# EasyEDA Pro project ProProject_AstrAlim_2024-04-22.epro, board AstrAlim PCB
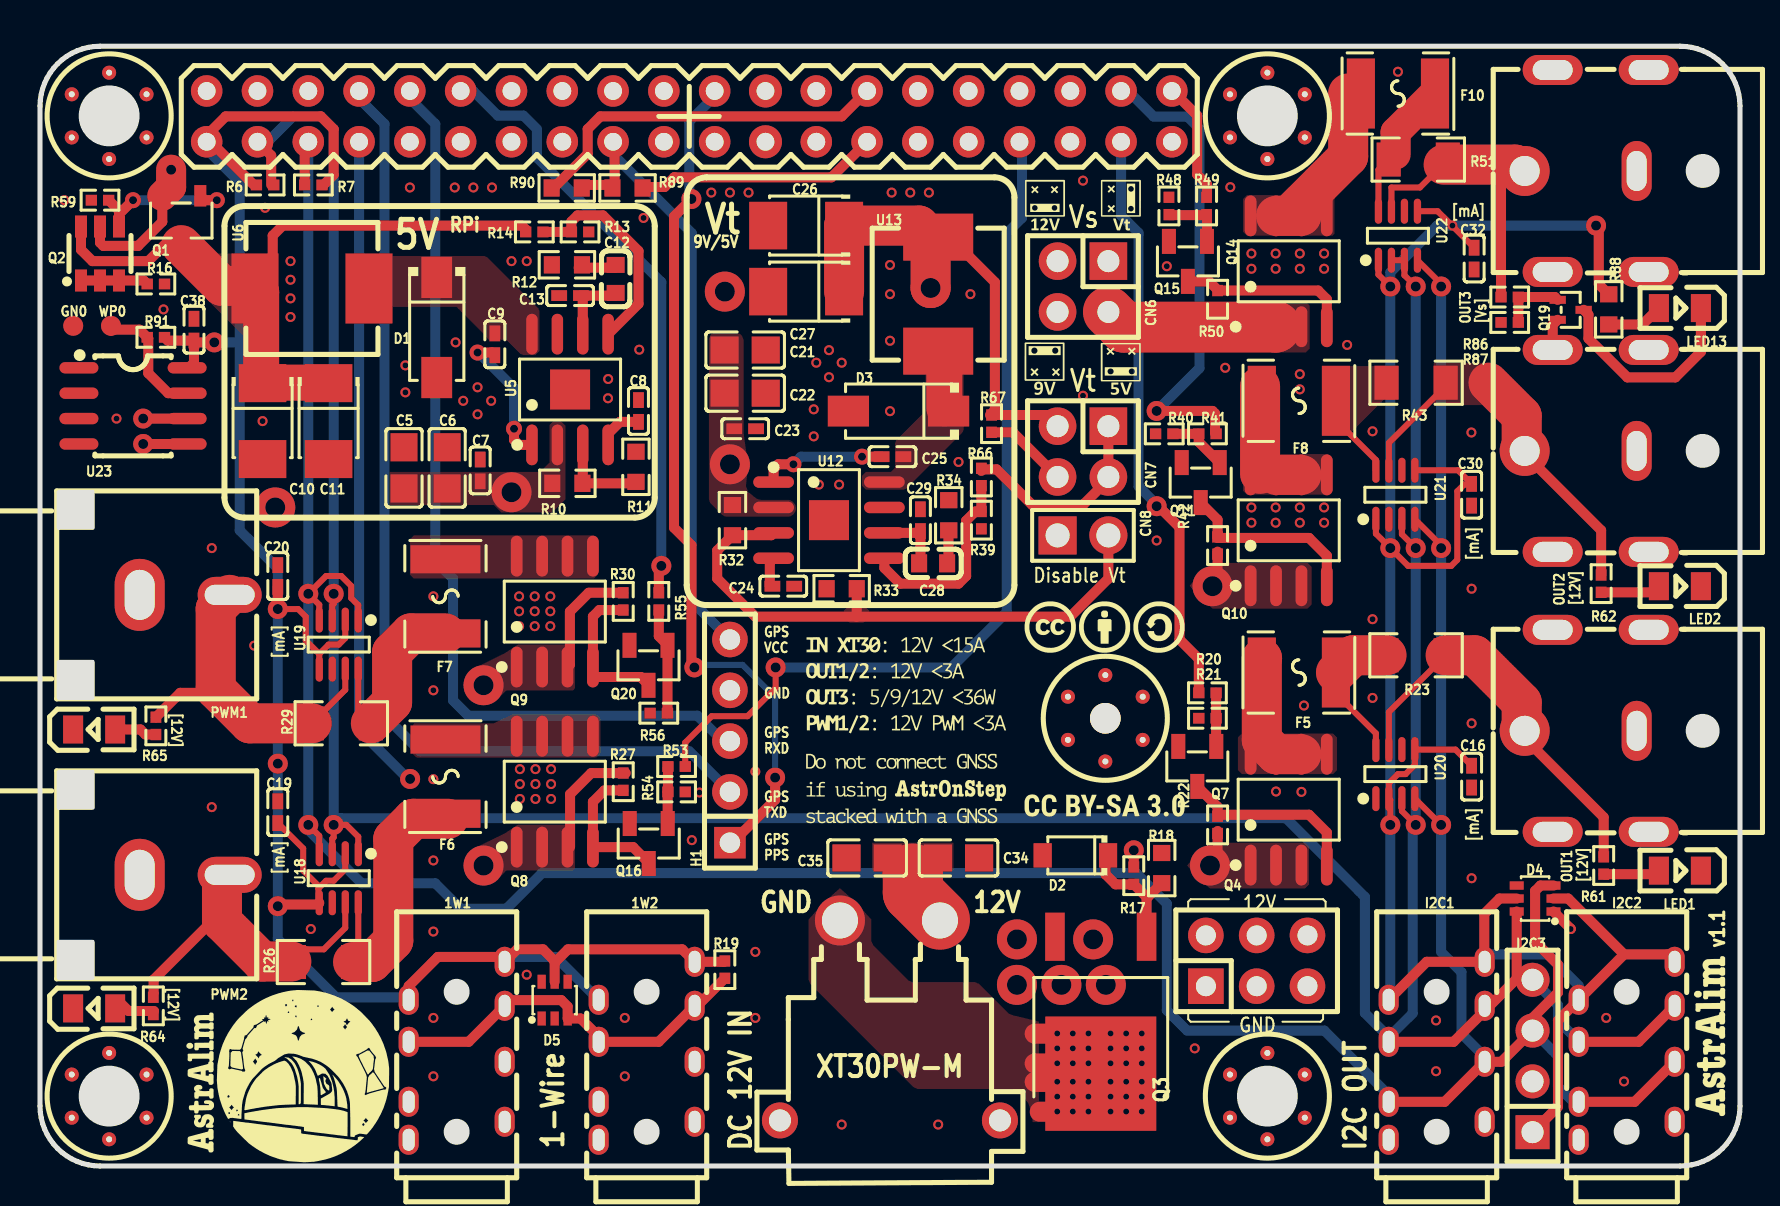
[diagram p2: board, top side]
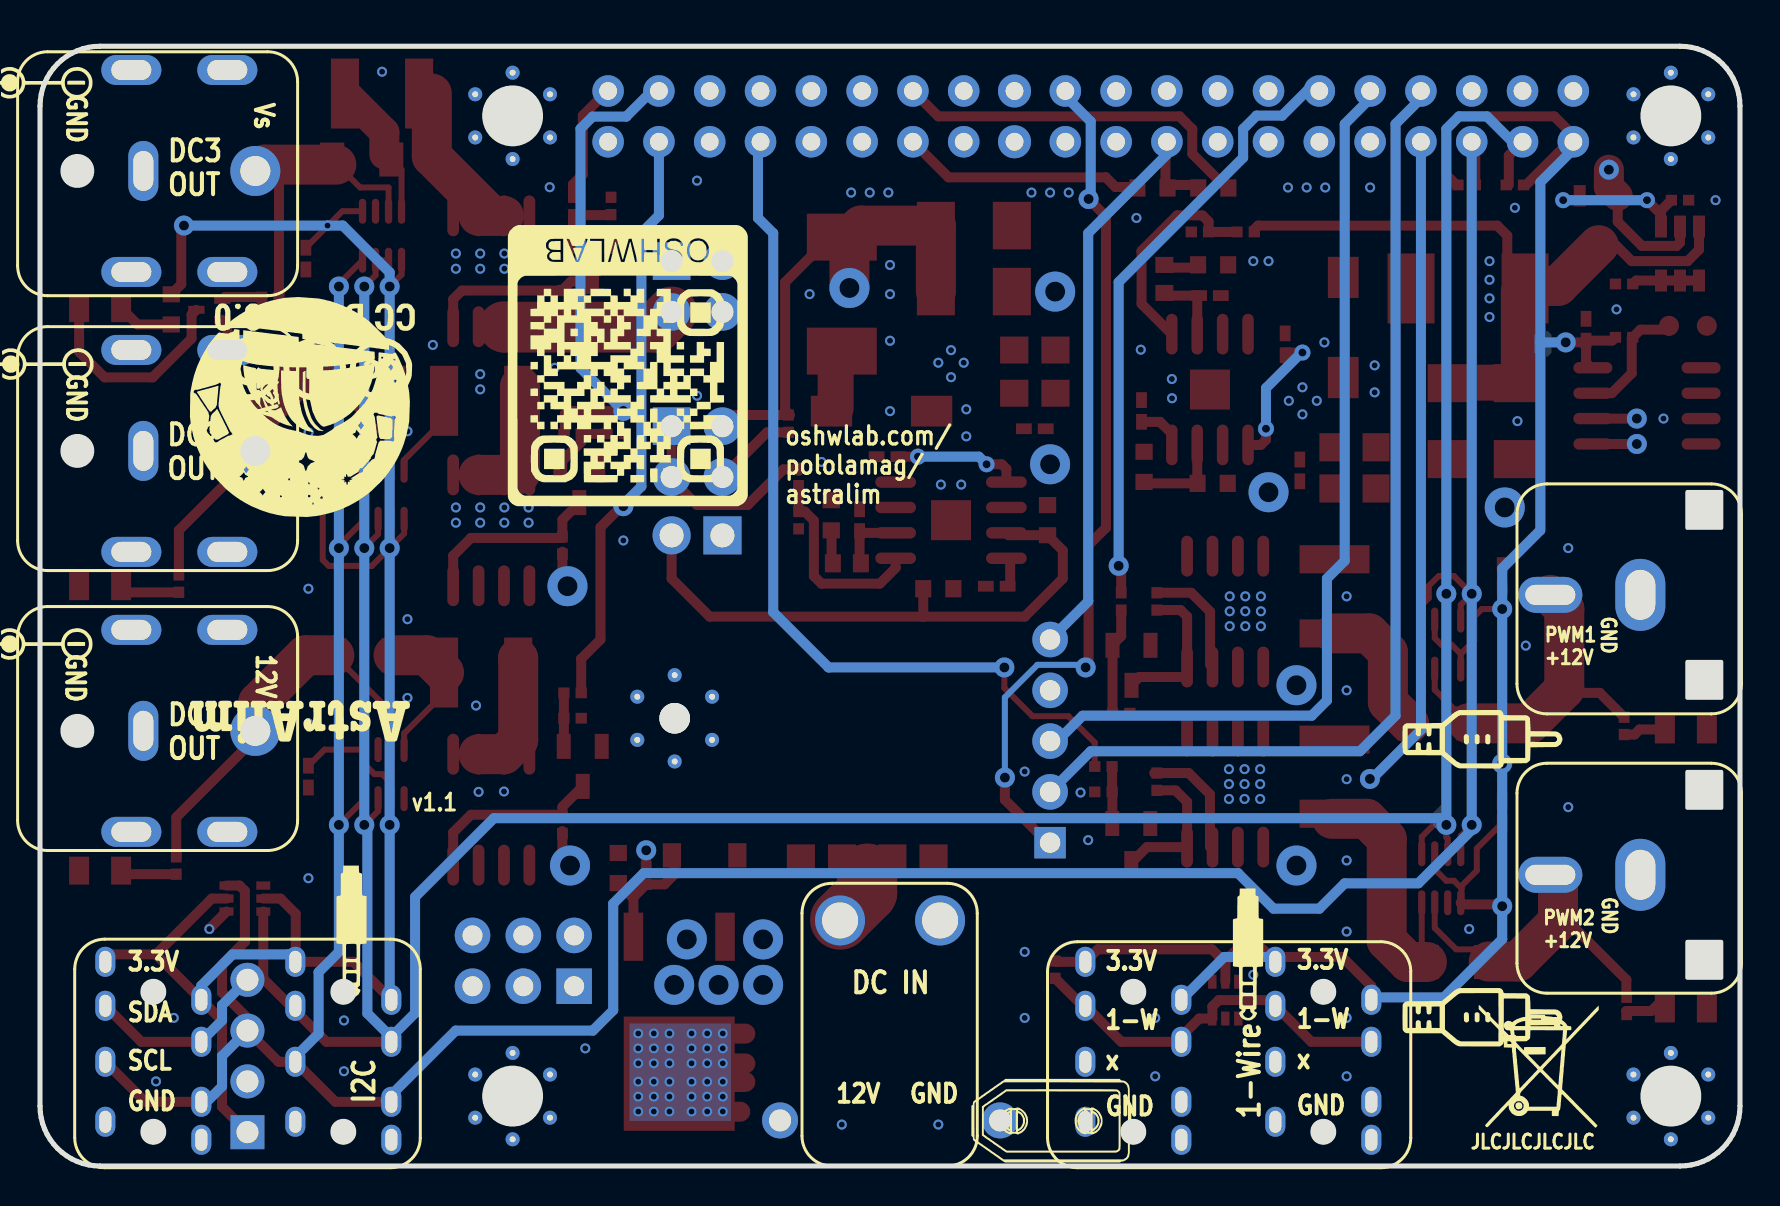
[diagram p3: board, bottom side, seen from below]

Outline 85 x 56 mm; copper layers: Top Layer, Inner1, Inner2, Inner3, Inner4, Inner5, Inner6, Inner7, Inner8, Inner9, Inner10, Inner11, Inner12, Inner13, Inner14, Inner15, Inner16, Inner17, Inner18, Inner19, Inner20, Inner21, Inner22, Inner23, Inner24, Inner25, Inner26, Inner27, Inner28, Inner29, Inner30, Bottom Layer. Coordinates in mm from the lower left corner of the outline.
Stack: Top Layer 0.035mm 外层铜厚1oz / Dielectric1 0.2104mm 7628 RC49% 8.6mil / Inner1 0.0152mm 内层铜厚 / Dielectric2 1.065mm 1.1mm H/HOZ 含铜 / Inner2 0.0152mm 内层铜厚 / Dielectric3 0.2104mm 7628 RC49% 8.6mil / Bottom Layer 0.035mm 外层铜厚1oz

## Design rules (mm)
template: Custom Config
spacing copperThickness1oz (default): track to track 0.102, other pairs 0.152 to 0.3
spacing copperThickness2oz: track to track 0.203, other pairs 0.152 to 0.3
spacing safeClearance1: track to track 0.152, other pairs 0.152 to 0.3
track width copperThickness1oz (default): min 0.3, default 0.5, max 6
track width copperThickness2oz: min 0.203, default 0.254, max 2.54
differential pair differentialPair (default): width min 0.127, default 0.254, max 2.54; gap min 0.152, default 0.152
via viaSize (default): diameter min 0.5, default 0.61, max 10; hole min 0.3, default 0.305, max 6.299

## Placement (name value [footprint] x y rotation side)
1W1  PJ-35372  [audio-th_pj-35372]  20.83 5.76 180 top
1W2  PJ-35372  [audio-th_pj-35372]  30.33 5.76 180 top
C5  4.7uF  [C0805]  18.2 34.91 270 top
C6  4.7uF  [C0805]  20.36 34.91 270 top
C7  10nF  [C0402]  22.01 34.79 270 top
C8  10nF  [C0402]  29.92 37.76 270 top
C9  10nF  [C0402]  22.74 41.09 90 top
C10  47uF  [CAP-SMD_L3.5-W2.8-R-RD]  11.13 37.25 90 top
C11  47uF  [CAP-SMD_L3.5-W2.8-R-RD]  14.43 37.25 90 top
C12  2.2nF  [C0603]  28.78 44.36 270 top
C13  22pF  [C0402]  26.5 43.53 0 top
C16  100nF  [C0402]  71.58 19.47 270 top
C19  100nF  [C0402]  11.89 17.69 90 top
C20  100nF  [C0402]  11.89 29.5 90 top
C21  4.7uF  [C0805]  35.26 40.81 180 top
C22  4.7uF  [C0805]  35.26 38.65 180 top
C23  10nF  [C0402]  35.26 36.87 180 top
C24  10nF  [C0402]  37.16 29 180 top
C25  10nF  [C0402]  42.62 35.47 0 top
C26  47uF  [CAP-SMD_L3.5-W2.8-R-RD]  38.31 47.03 0 top
C27  47uF  [CAP-SMD_L3.5-W2.8-R-RD]  38.31 43.73 0 top
C28  2.2nF  [C0603]  44.66 30.14 180 top
C29  22pF  [C0402]  44.02 32.3 270 top
C30  100nF  [C0402]  71.58 33.57 270 top
C32  100nF  [C0402]  71.71 45.38 270 top
C34  22uF  [C0805]  45.93 15.41 180 top
C35  22uF  [C0805]  41.35 15.41 0 top
C38  100nF  [C0402]  7.7 41.82 270 top
CN5  PM254-2-03-Z-8.5  [hdr-th_6p-p2.54-v-f-r2-c3-s2.54]  60.83 10.26 0 top
CN6  PH-00068  [HDR-TH_4P-P2.54-V-M-R2-C2-S2.54]  52.15 43.98 180 top
CN7  PH-00068  [HDR-TH_4P-P2.54-V-M-R2-C2-S2.54]  52.15 35.73 180 top
CN8  PZ254V-11-02P  [hdr-th_2p-p2.54-v-m]  52.15 31.54 0 top
D1  SS54  [SMA_L4.4-W2.8-LS5.4-R-RD]  19.84 41.94 270 top
D2  MM1Z15  [SOD-123_L2.7-W1.6-LS3.7-RD]  51.77 15.53 180 top
D3  SS54  [SMA_L4.4-W2.8-LS5.4-R-RD]  42.92 37.75 180 top
D4  BAV99S,115  [SOT-363_L2.0-W1.3-P0.65-LS2.1-TL]  74.75 13.38 180 top
D5  BAV99S,115  [SOT-363_L2.0-W1.3-P0.65-LS2.1-TL]  25.73 8.3 90 top
DC0  XT30PW-M  [CONN-TH_XT30PW-M]  42.5 7.28 0 top
DC1  DC-042C-W-2.0  [dc-in-th_dc-042c-w-2.0]  77.33 21.76 180 top
DC2  DC-042C-W-2.0  [dc-in-th_dc-042c-w-2.0]  77.33 35.76 180 top
DC3  DC-042C-W-2.0  [dc-in-th_dc-042c-w-2.0]  77.33 49.76 180 top
F5  SMD1812P300SLR/24  [F1812]  62.94 24.68 180 top
F6  SMD1812P300SLR/24  [F1812]  20.27 19.47 90 top
F7  SMD1812P300SLR/24  [F1812]  20.27 28.49 90 top
F8  SMD1812P300SLR/24  [F1812]  62.94 38.27 180 top
F10  SMD1812P300SLR/24  [F1812]  67.9 53.64 180 top
GN0  -  [test-point-0.5mm]  1.66 42.02 180 top
H1  2.54-1*5P  [hdr-th_5p-p2.54-v-f]  34.5 21.25 90 top
I2C1  PJ-35372  [audio-th_pj-35372]  69.83 5.76 180 top
I2C2  PJ-35372  [audio-th_pj-35372]  79.33 5.76 180 top
I2C3  2.54-1*4P  [hdr-th_4p-p2.54-v-f]  74.63 5.5 90 top
LED1  NCD0805R1  [LED0805-R-RD]  81.99 14.77 180 top
LED2  NCD0805R1  [LED0805-R-RD]  81.99 29 180 top
LED4  NCD0805R1  [LED0805-R-RD]  2.71 7.88 0 top
LED5  NCD0805R1  [LED0805-R-RD]  2.71 21.83 0 top
LED13  NCD0805R1  [LED0805-R-RD]  81.99 42.91 180 top
NOREF  -  [Pad_e1964]  51.4 21.31 0 top
NOREF#2  -  [Pad_e1969]  55.14 21.31 0 top
NOREF#3  -  [Pad_e1977]  53.27 24.55 0 top
NOREF#4  -  [Pad_e599]  53.27 22.39 180 top
NOREF#5  -  [Pad_e1971]  55.14 23.47 0 top
NOREF#6  -  [Pad_e1967]  53.27 20.23 0 top
NOREF#7  -  [Pad_e1979]  51.4 23.47 0 top
PWM1  AV-5  [rcj-04]  6.93 28.56 270 top
PWM2  AV-5  [rcj-04]  6.93 14.56 270 top
Q1  DMMT5401-7-F  [SOT-23-6_L2.9-W1.6-P0.95-LS2.8-BR]  3 45.63 270 top
Q2  AP2317A  [SOT-23-3_L2.9-W1.6-P1.90-LS2.8-BR]  7.06 47.28 90 top
Q3  DMTH4004LK3-13  [TO-252-2_L6.6-W6.1-P4.58-LS9.9-TL]  53.04 8.04 270 top
Q4  NCE30P12S  [soic-8_l4.9-w3.9-p1.27-ls6.0-bl]  62.44 17.82 0 top
Q7  MMBT3904  [SOT-23-3_L2.9-W1.3-P1.90-LS2.4-BR]  57.87 19.98 90 top
Q8  NCE30P12S  [SOIC-8_L4.9-W3.9-P1.27-LS6.0-BL]  25.74 18.72 0 top
Q9  NCE30P12S  [SOIC-8_L4.9-W3.9-P1.27-LS6.0-BL]  25.74 27.73 0 top
Q10  NCE30P12S  [soic-8_l4.9-w3.9-p1.27-ls6.0-bl]  62.44 31.79 0 top
Q11  MMBT3904  [SOT-23-3_L2.9-W1.3-P1.90-LS2.4-BR]  58.03 34.18 90 top
Q14  NCE30P12S  [SOIC-8_L4.9-W3.9-P1.27-LS6.0-BL]  62.44 44.75 0 top
Q15  MMBT3904  [SOT-23-3_L2.9-W1.3-P1.90-LS2.4-BR]  57.4 45.24 90 top
Q16  MMBT3904  [SOT-23-3_L2.9-W1.3-P1.90-LS2.4-BR]  30.44 16.13 90 top
Q19  MMBT3904TT1G  [SC-75-3_L1.6-W0.8-P1.00-LS1.6-BR]  76.53 42.82 180 top
Q20  MMBT3904  [SOT-23-3_L2.9-W1.3-P1.90-LS2.4-BR]  30.43 25.04 90 top
R6  10kΩ  [R0402]  11.26 49.06 180 top
R7  10kΩ  [R0402]  13.67 49.06 0 top
R10  665kΩ  [R0603]  26.37 34.14 180 top
R11  130kΩ  [R0603]  29.8 34.97 270 top
R12  39kΩ  [R0603]  26.35 45.07 180 top
R13  1.96kΩ  [R0402]  27 46.71 180 top
R14  10.2kΩ  [R0402]  24.72 46.71 180 top
R16  10kΩ  [R0402]  5.79 44.11 180 top
R17  1kΩ  [R0402]  54.69 14.52 270 top
R18  470kΩ  [R0603]  56.09 14.9 270 top
R19  4.7kΩ  [R0402]  34.24 9.82 90 top
R20  10kΩ  [R0402]  58.37 22.39 0 top
R21  1kΩ  [R0402]  58.37 23.66 0 top
R22  1kΩ  [R0402]  58.88 17.06 270 top
R23  10mΩ  [R1206]  68.8 25.54 180 top
R26  10mΩ  [R1206]  14.18 10.2 0 top
R27  1kΩ  [R0402]  29.16 19.22 90 top
R29  10mΩ  [R1206]  15.06 22.14 0 top
R30  1kΩ  [R0402]  29.16 28.23 90 top
R32  665kΩ  [R0603]  34.62 32.3 90 top
R33  82kΩ  [R0603]  40.08 28.87 0 top
R34  39kΩ  [R0603]  45.44 32.54 90 top
R39  1.96kΩ  [R0402]  47.07 32.3 90 top
R40  10kΩ  [R0402]  56.21 36.62 0 top
R41  1kΩ  [R0402]  58.37 36.62 180 top
R42  1kΩ  [R0402]  58.88 31.03 270 top
R43  10mΩ  [R1206]  68.8 39.17 180 top
R48  10kΩ  [R0402]  56.45 48.01 270 top
R49  1kΩ  [R0402]  58.33 48.01 270 top
R50  1kΩ  [R0402]  58.88 43.35 270 top
R51  10mΩ  [R1206]  68.91 50.33 180 top
R53  1kΩ  [R0402]  31.83 19.98 180 top
R54  10kΩ  [R0402]  31.83 18.71 180 top
R55  1kΩ  [R0402]  30.94 28.23 270 top
R56  10kΩ  [R0402]  30.94 22.65 0 top
R59  47kΩ  [R0402]  3 48.3 0 top
R61  470Ω  [R0402]  78.18 15.03 270 top
R62  470Ω  [R0402]  78.06 29.12 270 top
R64  470Ω  [R0402]  5.67 8.01 270 top
R65  470Ω  [R0402]  5.79 22.01 270 top
R66  10.2kΩ  [R0402]  47.07 34.46 90 top
R67  10kΩ  [R0402]  47.58 37.12 90 top
R86  10kΩ  [R0402]  73.49 43.46 180 top
R87  10kΩ  [R0402]  73.49 42.19 0 top
R88  68Ω  [R0603]  78.44 42.84 270 top
R89  3.9kΩ  [R0603]  29.38 48.91 180 top
R90  3.9kΩ  [R0603]  26.34 48.91 0 top
R91  1kΩ  [R0402]  5.79 41.44 0 top
U0  RASPI HAT FULL  [rasberrypi-3-hat-ext]  8.33 53.76 0 top
U5  TPS54531DDAR  [SOIC-8_L5.0-W4.0-P1.27-LS6.0-BL-EP2.0]  26.5 38.83 0 top
U6  4.7uH  [IND-SMD_L7.2-W6.6_GPSR07X0]  13.6 43.89 180 top
U12  TPS54531DDAR  [SOIC-8_L5.0-W4.0-P1.27-LS6.0-BL-EP2.0]  39.45 32.3 270 top
U13  4.7uH  [IND-SMD_L7.2-W6.6_GPSR07X0]  44.91 43.6 90 top
U18  INA219AIDCNR  [sot-23-8_l3.0-w1.7-p0.65-ls2.8-br]  14.94 14.39 90 top
U19  INA219AIDCNR  [sot-23-8_l3.0-w1.7-p0.65-ls2.8-br]  14.94 26.08 90 top
U20  INA219AIDCNR  [sot-23-8_l3.0-w1.7-p0.65-ls2.8-br]  67.77 19.6 270 top
U21  INA219AIDCNR  [sot-23-8_l3.0-w1.7-p0.65-ls2.8-br]  67.77 33.57 270 top
U22  INA219AIDCNR  [sot-23-8_l3.0-w1.7-p0.65-ls2.8-br]  67.9 46.52 270 top
U23  AT24C32D-SSHM-T  [SOIC-8_L5.0-W4.0-P1.27-LS6.0-BL]  4.65 38.01 270 top
WP0  -  [test-point-0.5mm]  3.55 42.02 180 top

## Footprints (pads in the part's own frame, mm; a bottom-side part is the same pattern mirrored in y, then rotated)
audio-th_pj-35372
  oval 1x1.5 hole 0.6x1.1: 1(-2.4,3.55) 2(-2.4,0.55) 3(-2.4,-2.25) 4(-2.4,-4.45) 5(2.4,4.45) 6(2.4,2.55) 7(2.4,-0.45) 8(2.4,-2.55)
C0402
  rect 0.79x0.54 smd: 1(-0.545,0) 2(0.545,0)
C0603
  rect 0.8x0.9 smd: 1(-0.7,0) 2(0.7,0)
C0805
  rect 1.41x1.35 smd: 1(-1.03,0) 2(1.03,0)
CAP-SMD_L3.5-W2.8-R-RD
  rect 1.9x2.376 smd: 1(1.899,0) 2(-1.899,0)
CONN-TH_XT30PW-M
  round 2.5 hole 1.8: 1(-2.5,5) 2(2.5,5)
  round 1.8 hole 1.1: 3(5.5,-5) 4(-5.5,-5)
dc-in-th_dc-042c-w-2.0
  oval 3x1.5 hole 2x1: 2(-3.1,5.05) 2(-3.1,-5.05) 2(1.7,5.05) 2(1.7,-5.05)
  oval 1.5x3 hole 1x2: 3(-2.5,0)
  round 2.5 hole 1.5: 4(3.1,0)
F1812
  rect 1.407x3.499 smd: 1(-1.853,0) 2(1.853,0)
hdr-th_2p-p2.54-v-m
  rect 1.905x1.905 hole 1.2: 1(-1.27,0)
  round 1.905 hole 1.2: 2(1.27,0)
hdr-th_4p-p2.54-v-f
  rect 1.7x1.7 hole 1.1: 1(-3.81,0)
  round 1.7 hole 1.1: 2(-1.27,0) 3(1.27,0) 4(3.81,0)
HDR-TH_4P-P2.54-V-M-R2-C2-S2.54
  rect 1.879x1.879 hole 1.1: 1(-1.27,-1.27)
  round 1.879 hole 1.1: 2(-1.27,1.27) 3(1.27,-1.27) 4(1.27,1.27)
hdr-th_5p-p2.54-v-f
  rect 1.575x1.575 hole 1.02: 1(-5.08,0)
  round 1.778 hole 1.02: 2(-2.54,0) 3(0,0) 4(2.54,0) 5(5.08,0)
hdr-th_6p-p2.54-v-f-r2-c3-s2.54
  rect 1.778x1.778 hole 1: 1(-2.54,-1.27)
  round 1.778 hole 1: 2(-2.54,1.27) 3(0,-1.27) 4(0,1.27) 5(2.54,-1.27) 6(2.54,1.27)
IND-SMD_L7.2-W6.6_GPSR07X0
  rect 2.35x3.5 smd: 1(-2.85,0) 2(2.85,0)
LED0805-R-RD
  rect 1x1.399 smd: 1(1.05,0) 2(-1.05,0)
Pad_e599
  round 1.524 hole 3: 41(0,0)
Pad_e1964
  round 0.7 hole 0.3: 42(0,0)
Pad_e1967
  round 0.7 hole 0.3: 44(0,0)
Pad_e1969
  round 0.7 hole 0.3: 46(0,0)
Pad_e1971
  round 0.7 hole 0.3: 48(0,0)
Pad_e1977
  round 0.7 hole 0.3: 50(0,0)
Pad_e1979
  round 0.7 hole 0.3: 52(0,0)
R0402
  rect 0.566x0.54 smd: 1(-0.433,0) 2(0.433,0)
R0603
  rect 0.806x0.864 smd: 1(-0.753,0) 2(0.753,0)
R1206
  rect 1.208x1.701 smd: 1(-1.479,0) 2(1.479,0)
rasberrypi-3-hat-ext
  round 1.575 hole 0.889: 1(0,-2.54) 2(0,0) 3(2.54,-2.54) 4(2.54,0) 5(5.08,-2.54) 6(5.08,0) 7(7.62,-2.54) 8(7.62,0) 9(10.16,-2.54) 10(10.16,0) 11(12.7,-2.54) 12(12.7,0) 13(15.24,-2.54) 14(15.24,0) 15(17.78,-2.54) 16(17.78,0) 17(20.32,-2.54) 18(20.32,0) 19(22.86,-2.54) 20(22.86,0) 21(25.4,-2.54) 22(25.4,0) 25(30.48,-2.54) 26(30.48,0) 27(33.02,-2.54) 28(33.02,0) 29(35.56,-2.54) 30(35.56,0) 31(38.1,-2.54) 32(38.1,0) 33(40.64,-2.54) 34(40.64,0) 35(43.18,-2.54) 36(43.18,0) 37(45.72,-2.54) 38(45.72,0) 39(48.26,-2.54) 40(48.26,0)
  round 1.651 hole 0.889: 23(27.94,-2.54) 24(27.94,0)
  round 0.7 hole 0.3: 42(-6.747,-2.324) 42(-6.747,-51.346) 42(51.166,-2.324) 42(51.166,-51.346) 44(-4.877,-3.404) 44(-4.877,-52.425) 44(53.035,-3.404) 44(53.035,-52.425) 46(-3.007,-2.324) 46(-3.007,-51.346) 46(54.905,-2.324) 46(54.905,-51.346) 48(-3.007,-0.165) 48(-3.007,-49.187) 48(54.905,-0.165) 48(54.905,-49.187) 50(-4.877,0.914) 50(-4.877,-48.108) 50(53.035,0.914) 50(53.035,-48.108) 52(-6.747,-0.165) 52(-6.747,-49.187) 52(51.166,-0.165) 52(51.166,-49.187)
rcj-04
  oval 3.6x2.5 hole 2.5x1.5: 1(0,-1.95)
  oval 1.8x3.2 hole 1x2.5: 2(0,2.55)
SC-75-3_L1.6-W0.8-P1.00-LS1.6-BR
  rect 0.816x0.4 smd: 1(0.65,-0.5) 2(0.65,0.5) 3(-0.65,0)
SMA_L4.4-W2.8-LS5.4-R-RD
  rect 2.062x1.539 smd: 1(2.503,0) 2(-2.503,0)
SOD-123_L2.7-W1.6-LS3.7-RD
  rect 0.91x1.22 smd: 1(-1.635,0) 2(1.635,0)
soic-8_l4.9-w3.9-p1.27-ls6.0-bl
  oval 0.588x2.045 smd: 1(-1.905,-2.772) 2(-0.635,-2.772) 3(0.635,-2.772) 4(1.905,-2.772) 5(1.905,2.772) 6(0.635,2.772) 7(-0.635,2.772) 8(-1.905,2.772)
SOIC-8_L4.9-W3.9-P1.27-LS6.0-BL
  oval 0.588x2.045 smd: 1(-1.905,-2.772) 2(-0.635,-2.772) 3(0.635,-2.772) 4(1.905,-2.772) 5(1.905,2.772) 6(0.635,2.772) 7(-0.635,2.772) 8(-1.905,2.772)
SOIC-8_L5.0-W4.0-P1.27-LS6.0-BL
  oval 0.569x1.95 smd: 1(-1.905,-2.705) 2(-0.635,-2.705) 3(0.635,-2.705) 4(1.905,-2.705) 5(1.905,2.705) 6(0.635,2.705) 7(-0.635,2.705) 8(-1.905,2.705)
SOIC-8_L5.0-W4.0-P1.27-LS6.0-BL-EP2.0
  oval 0.574x2.038 smd: 1(-1.905,-2.769) 2(-0.635,-2.769) 3(0.635,-2.769) 4(1.905,-2.769) 5(1.905,2.769) 6(0.635,2.769) 7(-0.635,2.769) 8(-1.905,2.769)
  rect 2x2 smd: 9(0,0)
SOT-23-3_L2.9-W1.3-P1.90-LS2.4-BR
  rect 1.25x0.7 smd: 1(1,-0.95) 2(1,0.95) 3(-1,0)
SOT-23-3_L2.9-W1.6-P1.90-LS2.8-BR
  rect 1.07x0.6 smd: 1(1.235,-0.95) 2(1.235,0.95) 3(-1.235,0)
SOT-23-6_L2.9-W1.6-P0.95-LS2.8-BR
  rect 1.1x0.6 smd: 1(1.35,-0.95) 2(1.35,0) 3(1.35,0.95) 4(-1.35,0.95) 5(-1.35,0) 6(-1.35,-0.95)
sot-23-8_l3.0-w1.7-p0.65-ls2.8-br
  oval 1.252x0.364 smd: 1(1.226,-0.975) 2(1.226,-0.325) 3(1.226,0.325) 4(1.226,0.975) 5(-1.226,0.975) 6(-1.226,0.325) 7(-1.226,-0.325) 8(-1.226,-0.975)
SOT-363_L2.0-W1.3-P0.65-LS2.1-TL
  rect 0.7x0.42 smd: 1(-0.92,0.65) 2(-0.92,0) 3(-0.92,-0.65) 4(0.92,-0.65) 5(0.92,0) 6(0.92,0.65)
test-point-0.5mm
  round 1 smd: 1(0,0)
TO-252-2_L6.6-W6.1-P4.58-LS9.9-TL
  rect 2.409x0.979 smd: 1(-3.424,2.29) 3(-3.424,-2.29)
  rect 5.711x5.548 smd: 2(3.424,0)

## Nets
As in the schematic, except:
GND: 1W1.1 1W1.5 1W2.1 1W2.5 C5.1 C6.1 C7.1 C8.1 C10.2 C11.2 C13.1 C16.2 C19.2 C20.2 C21.1 C22.1 C23.1 C24.1 C26.2 C27.2 C29.1 C30.2 C32.2 C34.1 C35.1 C38.1 CN5.1 CN5.3 CN5.5 CN8.1 D1.1 D2.2 D3.1 D4.1 D4.4 D5.4 DC1.2 DC1.3 DC2.2 DC2.3 DC3.2 DC3.3 GN0.1 H1.4 I2C1.1 I2C1.5 I2C2.1 I2C2.5 I2C3.2 LED1.2 LED2.2 LED4.2 LED5.2 NOREF.42 NOREF#2.46 NOREF#3.50 NOREF#5.48 NOREF#6.44 NOREF#7.52 PWM1.1 PWM2.1 Q3.3 Q7.2 Q11.2 Q15.2 Q16.2 Q19.2 Q20.2 R11.1 R12.2 R13.1 R16.1 R18.1 R20.1 R33.1 R34.2 R39.1 R40.1 R48.1 R54.1 R56.1 R59.1 R87.1 U0.6 U0.9 U0.14 U0.20 U0.25 U0.30 U0.34 U0.39 U0.42 U0.44 U0.46 U0.48 U0.50 U0.52 U5.7 U5.9 U12.7 U12.9 U18.6 U19.6 U20.1 U20.6 U21.2 U21.6 U22.6 U23.3 U23.4
1-WIRE: 1W1.3 1W1.7 1W2.3 1W2.7 D5.3 R19.1 U0.7

Pads without a net: 1W1 2 6; 1W2 2 6; CN6 3; D5 1 2 6; DC0 3 4; NOREF#4 41; U0 11 13 15 16 18 19 21 23 24 26 29 31 32 35 36; U23 1 2

## Via types
v1: diameter 1, hole 0.5, Top Layer to Bottom Layer, 30 vias
v2: diameter 0.5, hole 0.3, Top Layer to Bottom Layer, 164 vias
v3: diameter 2, hole 1, Top Layer to Bottom Layer, 14 vias
v4: diameter 0.8, hole 0.4, Top Layer to Bottom Layer, 6 vias

## Routing (per net, layer and track width the routed paths; a pad name or vN(x,y) marks a point on that pad's centre or on a via; arc(x,y) is an arc through that point)
+3.3V: length 324.2
  Top Layer w0.3: U19.5 13.96,25.61 ; 13.96,25.61 13.29,26.28 13.29,27.47 12.91,27.85 v1(11.89,27.85) ; 13.96,25.61 14.43,26.08 14.94,26.08 15.26,26.4 U19.2 ; 13.92,13.88 14.3,14.27 14.68,14.27 15.26,14.84 U18.2 ; 13.92,13.88 13.92,13.12 ; 13.92,13.88 13.92,14.01 13.16,14.77 13.16,15.88 C19.1 ; U21.5 70.9,34.8 C30.1 71.54,34.08 71.2,34.08 70.86,33.74 70.86,30.31 70.56,30.01 68.41,30.01 v1(67.52,30.9) 66.8,31.62 U21.1 ; v1(67.52,43.98) 66.92,44.58 U22.1 ; U22.5 69.88,47.75 C32.1 ; v1(67.52,17.06) 67.52,18.3 U20.2 67.44,19.15 67.9,19.6 68.28,19.6 68.75,20.07 U20.5 70.77,20.83 C16.1
  Top Layer w0.5: 79.2,10.58 81.36,10.58 I2C2.4 ; 79.2,10.58 I2C2.8 75.9,7.28 75.9,2.96 I2C3.1 ; 79.2,10.58 76.41,13.38 D4.2 ; 27.44,49.06 28.73,49.06 28.73,51.15 U0.17 ; v1(11.89,27.85) C20.1 ; 25.78,10.21 25.15,10.84 23.86,10.84 1W1.4 22.99,10.45 19.89,10.45 18.43,9 1W1.8 ; 25.78,10.21 25.73,10.17 D5.5 ; 25.78,10.21 26.4,10.84 32.11,10.84 1W2.4 34.2,10.21 R19.2 ; C38.2 7.79,41.19 v1(8.72,41.19) ; C38.2 7.7,40.17 7.45,39.92 7.1,39.92 ; C38.2 6.39,41.28 R91.2 ; v1(11.89,13) 11.98,13.08 13.92,13.08 13.92,13.12 U18.5 ; D4.5 72.98,13.38 72.22,12.61 72.22,10.23 I2C1.4 69.33,10.21 I2C1.8 ; R7.2 14.18,49.06 14.68,49.57 14.68,51.85 14.04,52.49 9.28,52.49 8.33,51.54 U0.1 8.54,51.22 10.7,49.06 ; R88.1 77.94,44.09 77.94,46.9 v1(77.8,47.03)
  Inner2 w0.5: U0.17 28.65,51.76 ; 28.65,51.76 28.65,51.86 28.02,52.49 9.22,52.49 8.33,51.6 U0.1 ; 28.65,51.76 29.99,53.09 29.99,54.31 30.71,55.03 57.1,55.03 57.86,54.27 57.86,48.4 59.1,47.16 64.34,47.16 v1(67.52,43.98)
  Bottom Layer w0.5: 18.38,8.82 18.38,8.43 14.8,8.43 11.89,11.34 v1(11.89,13) v1(11.89,20.12) v1(11.89,27.85) 11.89,29.89 9.98,31.79 9.98,41.21 ; 9.98,41.21 9.98,49.19 8.33,50.84 U0.1 ; 9.98,41.21 9.97,41.19 v1(8.72,41.19) ; v1(77.8,47.03) v2(70.62,47.03) 69.86,47.03 67.52,44.69 v1(67.52,43.98) v1(67.52,30.9) v1(67.52,17.06) 67.52,8.73 ; H1.5 32.59,28.23 32.59,46.65 28.65,50.59 U0.17 ; I2C1.4 72.6,10.58 75.37,10.58 76.93,9.02 I2C2.8 ; 1W2.8 25.79,10.45 23.48,10.45 1W1.4
+5V_A: length 34.4
  Top Layer w0.5: Q2.3 6.21,46.05 5.41,45.25 2.62,45.25 2.05,45.82 Q1.6 ; R14.2 24.28,46.84 24.09,47.03 12.14,47.03 11.64,46.53 11.64,44.9 10.75,44.01
  Top Layer w1.8: 13.34,39.17 11.09,39.17 11.06,39.2 11.06,43.7 10.75,44.01
  Top Layer w2: Q2.3 9.1,44.01 10.75,44.01
+5V_PI: length 14.6
  Top Layer w0.5: Q1.5 3,46.18 3.17,46.02 4.91,46.02 6.11,47.22 Q2.2
  Top Layer w1.5: Q2.2 6.56,48.96 v1(6.56,49.83)
  Inner1 w1.1: 6.56,49.95 6.56,51.73 8.33,53.51 8.33,53.89
  Inner2 w1.3: 8.46,53.89 8.46,53.76
  Inner2 w1.5: U0.2 U0.4
+9V: length 37.7
  Top Layer w0.5: CN7.3 50.32,37.56 R67.2 ; 44.53,46.45 45.49,46.45 47.74,44.2 47.74,37.8 47.5,37.56
  Top Layer w2: C27.1 C26.1 43.95,47.03 44.53,46.45 v3(44.53,43.91)
  Inner2 w2.2: v3(44.53,43.91) 44.53,45.89 46.18,47.54 51.77,47.54 53.42,45.89 CN6.1
+12V: length 50.3
  Top Layer w0.5: v3(58.63,29) 58.88,29.25 58.88,30.72 ; 58.88,16.75 58.88,15.41 v3(58.5,15.03) ; 29.29,19.65 27.56,19.65 26.5,18.59 26.5,15.95 ; v1(54.69,15.79) R17.1 ; Q9.3 26.5,25.07 26.5,27.73 27.44,28.67 R30.2
  Top Layer w3: 45,12.32 43.64,13.68 43.64,14.61 43.62,14.62
  Inner2 w2: 63.4,11.53 CN5.4 58.32,11.53 57.99,11.86 57.99,14.52 v3(58.5,15.03)
  Inner2 w2.2: v3(58.63,29) 58.63,37.72 56.17,40.17 51.68,40.17 50.88,40.98 CN6.4
  Inner2 w4: 45.04,14.98 45.04,12.36 45,12.32
  vias: v2(23.95,28.49) v2(23.95,27.74) v2(23.95,27) v2(23.99,19.85) v2(23.99,19.1) v2(23.99,18.36) v2(24.73,28.49) v2(24.73,27.74) v2(24.73,27) v2(24.77,19.85) v2(24.77,19.1) v2(24.77,18.36) v2(25.52,28.49) v2(25.52,27.74) v2(25.52,27) v2(25.55,19.85) v2(25.55,19.1) v2(25.55,18.36) v3(22.18,24.04) v3(22.18,15.03) v3(23.57,33.7) v3(34.5,35.09)
GND: length 2.8
  Top Layer w0.5: DC2.2 75.63,42.07 Q19.2 ; v2(76.53,11.85) 76.53,11.87 D4.1
  vias: v2(1.22,48.3) v2(3.83,37.38) v2(6.17,42.84) v2(8.59,30.9) v2(8.59,17.95) v2(10.71,26.02) v2(11.13,37.25) v2(11.26,47.92) v2(12.53,45.25) v2(12.53,44.32) v2(12.53,43.39) v2(12.53,42.46) v2(13.54,11.85) v2(18.27,40.04) v2(18.27,38.69) v2(18.49,48.94) v2(19.67,28.49) v2(19.67,23.79) v2(19.67,19.34) v2(19.67,15.28) v2(19.67,11.72) v2(19.67,7.41) v2(19.67,4.49) v2(20.74,48.94) v2(20.78,41.19) v2(21.16,38.27) v2(21.67,48.94) v2(21.88,38.94) v2(21.88,37.59) v2(22.56,38.27) v2(22.6,48.94) v2(23.57,45.25) v2(24.34,45.25) v2(24.34,9.57) v2(28.41,39.36) v2(28.4,38.39) v2(29.24,7.41) v2(29.24,4.49) v2(29.96,40.82) v2(30.18,47.41) v2(32.59,16.3) v2(32.97,18.68) v2(33.56,48.68) v2(34.5,48.68) v2(35.43,48.68) v2(35.77,19.73) v2(35.77,10.71) v2(35.77,7.41) v2(38.69,37.84) v2(38.69,36.49) v2(38.81,40.17) v2(38.94,34.08) v2(39.45,40.8) v2(39.45,39.45) v2(39.96,34.08) v2(40.08,40.17) v2(40.08,2.07) v2(42.58,48.68) v2(42.5,45.06) v2(42.5,43.6) v2(42.5,41.27) v2(42.5,37.75) v2(43.51,48.68) v2(44.44,48.68) v2(44.91,2.07) v2(45.93,35.21) v2(46.52,43.6) v2(52.15,49.28) v2(52.15,38.52) v2(55.83,31.28) v2(56.34,45) v2(57.74,5.88) v2(59.26,39.92) v2(59.52,48.95) v2(60.57,45.63) v2(60.57,44.87) v2(60.57,32.93) v2(60.57,32.17) v2(61.78,45.63) v2(61.78,44.87) v2(61.78,32.93) v2(61.78,32.17) v2(61.8,18.73) v2(62.99,45.63) v2(62.99,44.87) v2(62.99,39.6) v2(62.99,38.84) v2(62.99,32.93) v2(62.99,32.17) v2(63.07,18.71) v2(63.2,23.03) v2(64.21,45.63) v2(64.21,44.87) v2(64.21,32.93) v2(64.21,32.17) v2(65.36,41.06) v2(66.63,36.74) v2(66.63,27.35) v2(66.63,23.41) v2(67.9,54.72) v2(69.8,7.28) v2(69.8,4.74) v2(71.57,36.68) v2(71.58,28.87) v2(71.58,22.14) v2(71.58,14.39) v2(78.31,7.41) v2(79.2,4.23) v3(11.76,32.93) v3(34.24,43.73) v3(48.85,11.33) v3(48.85,9.06) v3(51.07,9.06) v3(52.66,11.33) v3(53.29,9.06)
GND_IN: length 8.5
  Top Layer w1: 50.73,4.21 49.73,4.21 ; 50.73,6.62 49.73,6.62 ; 50.73,5.13 49.73,5.13 ; 50.99,2.71 49.99,2.71
  Inner2 w1: 49.99,2.72 v2(50.86,2.72) 51.12,2.72 ; v2(50.86,4.22) 49.73,4.22 ; v2(50.86,6.63) 49.73,6.63 ; v2(50.86,5.14) 49.73,5.14
  vias: v2(50.86,5.88) v2(50.86,3.47) v2(51.64,6.63) v2(51.64,5.88) v2(51.64,5.14) v2(51.64,4.22) v2(51.64,3.47) v2(51.64,2.72) v2(52.42,6.63) v2(52.42,5.88) v2(52.42,5.14) v2(52.42,4.22) v2(52.42,3.47) v2(52.42,2.72) v2(53.53,6.63) v2(53.53,5.88) v2(53.53,5.14) v2(53.53,4.22) v2(53.53,3.47) v2(53.53,2.72) v2(54.31,6.63) v2(54.31,5.88) v2(54.31,5.14) v2(54.31,4.22) v2(54.31,3.47) v2(54.31,2.72) v2(55.09,6.63) v2(55.09,5.88) v2(55.09,5.14) v2(55.09,4.22) v2(55.09,3.47) v2(55.09,2.72)
1-WIRE: length 65.8
  Top Layer w0.5: R19.1 32.87,8.01 1W2.3 30.93,6.21 1W2.7 27.93,6.48 27.03,7.38 D5.3 26.38,7.98 26.06,8.3 23.52,8.3 1W1.3 21.43,6.21 1W1.7
  Inner2 w0.5: 23.38,7.81 22.05,9.14 22.05,11.2 18.51,14.74 v1(18.51,19.36)
  Bottom Layer w0.5: 18.43,19.33 15.95,21.81 U0.7
GPIO13_PWM1: length 44.5
  Top Layer w0.3: R53.1 32.26,21.17 33.58,22.49 35.37,22.49 36.78,23.9 v1(36.78,24.93)
  Bottom Layer w0.5: v1(36.78,24.93) 45.57,24.93 48.34,27.7 48.34,46.65 49.1,47.41 49.1,51.29
GPIO18_PWM0: length 30.4
  Top Layer w0.5: v1(31.07,30.01) 30.94,29.89 R55.1
  Bottom Layer w0.5: U0.12 21.66,53.76 22.89,52.53 24.17,52.53 24.84,51.86 24.84,50.43 31.07,44.2 v1(31.07,30.01)
GPIO20: length 23.7
  Top Layer w0.5: v1(55.83,37.76) 58.63,37.76 58.75,37.63 58.75,36.67 R41.1
  Bottom Layer w0.5: 54.08,53.68 54.49,53.68 55.69,52.48 57.37,52.48 57.97,51.87 57.97,39.9 v1(55.83,37.76)
GPIO21: length 6
  Top Layer w0.5: 56.65,53.74 57.86,52.54 57.86,49.58 58.35,49.09 58.35,48.46
GPIO26: length 29.2
  Top Layer w0.5: 57.94,23.66 57.94,25.35 57.95,25.36 56.97,26.33 56.97,31.94 55.92,33
  Bottom Layer w0.5: 55.92,33 54.93,33.99 54.93,46.66 54.05,47.54 U0.37
  vias: v1(55.83,33)
ID_SC: length 68.1
  Top Layer w0.5: v1(5.16,37.38) 7.1,37.38 ; 25.59,49.01 25.78,49.01 27.38,50.62 27.38,51.86 28.02,52.49 40.08,52.49 U0.28
  Inner2 w0.5: U0.28 41.02,53.76 40.08,52.82 40.08,50.21 36.27,46.4 11.89,46.4 10.75,45.25 10.75,39.79 9.48,38.52 6.3,38.52 v1(5.16,37.38)
ID_SD: length 61.9
  Top Layer w0.5: U0.27 39.58,49.44 31.71,49.44 ; 30.19,48.96 31.23,48.96 31.71,49.44 ; 31.71,49.44 31.71,49.45 ; v1(5.16,36.11) 7.1,36.11
  Inner2 w0.5: U0.27 41.1,50.97 41.1,45.25 38.05,42.2 14.3,42.2 13.16,41.06 13.16,37.51 11.76,36.11 v1(5.16,36.11)
PPS: length 43.5
  Top Layer w0.5: 32.72,48.21 v1(32.57,48.36) 31.7,47.49 31.7,31.92 32.57,31.05 32.57,25.08 v1(32.72,24.93) ; 34.46,16.02 36.76,18.31 v1(36.76,19.42)
  Bottom Layer w0.3: v1(32.72,24.93) 32.85,25.06 35.13,25.06 36.76,23.44 36.76,19.48
  Bottom Layer w0.5: U0.22 33.73,53.51 32.46,52.24 32.46,48.47 v1(32.57,48.36)
RXD: length 46.1
  Bottom Layer w0.5: U0.10 18.49,53.38 19.76,52.11 19.76,30.27 20.65,29.38 20.65,23.28 21.42,22.52 32.87,22.52 34.14,21.25 H1.3
SCL: length 182.5
  Top Layer w0.3: U22.4 70.06,44.11 v1(70.06,43.98) ; U18.4 13.96,16.51 v1(13.41,17.06) ; v1(70.06,17.06) 70.06,17.06 U20.4 ; v1(70.06,30.9) 70.06,31.03 U21.4 ; U19.4 13.96,28.07 v1(13.41,28.62) 14.3,29.5 15.06,29.5 15.56,29.01 15.56,28.4 15.91,28.05 U19.1
  Top Layer w0.5: U0.5 13.23,51.04 R7.1 ; I2C2.6 79.73,3.21 I2C2.2 ; I2C1.6 70.23,3.21 I2C1.2 73.07,5.21 I2C3.3 74.63,7.41 75.9,8.68 75.9,10.07 74.75,11.22 74.75,13.76 75.02,14.03 D4.3
  Bottom Layer w0.5: 67.71,3.28 64.21,6.77 57.36,6.77 56.34,7.79 56.34,13.12 54.82,14.65 25.1,14.65 23.32,12.87 21.03,12.87 19.76,14.14 16.08,14.14 13.41,16.81 v1(13.41,17.06) v1(13.41,28.62) U0.5 ; 72.48,5.21 71.07,6.62 71.07,9.69 70.06,10.71 v1(70.06,17.06) v1(70.06,30.9) v1(70.06,43.98) ; I2C2.6 76.66,3.21 75.9,3.98 75.9,5.5 I2C3.3 ; 67.68,3.21 67.52,3.21
SDA: length 172.7
  Top Layer w0.3: U22.2 U22.3 68.22,44.55 v1(68.79,43.98) ; U21.3 68.09,31.59 v1(68.79,30.9) ; U20.3 68.09,17.75 v1(68.79,17.06) ; U19.3 14.61,28.05 14.68,28.12 v1(14.68,28.62) ; U18.1 15.91,16.47 15.32,17.06 v1(14.68,17.06) 14.68,16.44 14.61,16.37 U18.3
  Top Layer w0.5: 67.68,6.21 70.68,6.21 73.78,9.31 73.84,9.31 ; 11.56,49.06 11.56,50.53 U0.3 ; I2C3.4 73.84,9.31 ; 73.84,9.31 D4.6 ; I2C2.7 79.93,6.21 I2C2.3
  Bottom Layer w0.5: I2C3.4 75.9,8.04 75.9,7.28 76.93,6.24 I2C2.7 ; U0.3 11.38,51.22 12.65,52.49 14.05,52.49 14.68,51.86 v1(14.68,28.62) v1(14.68,17.06) 15.02,17.39 62.31,17.39 66.25,13.45 66.25,7.65 67.44,6.45 68.63,7.64 68.63,16.91 v1(68.79,17.06) v1(68.79,30.9) v1(68.79,43.98)
TXD: length 50.6
  Bottom Layer w0.5: U0.8 15.95,53.38 17.22,52.11 17.22,22.52 19,20.74 32.46,20.74 H1.2
VS: length 8.7
  Top Layer w2.54: CN6.2 54.18,41.95 61.78,41.95 Q14.2
$1N4635: length 4.6
  Top Layer w0.5: R11.2 29.72,34.14 R10.1 27.14,34.16 U5.3
$1N4659: length 2.3
  Top Layer w0.5: C8.2 29,37.22 28.41,36.62 U5.4
$1N4694: length 7
  Top Layer w0.5: 21.92,40.68 22.61,40.68 C9.1 ; U5.1 23.95,36.06 23.7,36.32 v4(23.7,36.87)
  Bottom Layer w0.5: v4(23.7,36.87) 23.7,38.9 21.92,40.68
  vias: v4(21.88,40.68)
$1N5140: length 2
  Top Layer w0.5: 26.94,44.93 28.77,44.93 28.91,45.06
$1N5148: length 3.9
  Top Layer w0.5: U5.6 27.14,43.44 C13.2 28.77,43.53 28.91,43.66
$1N5310: length 10.9
  Top Layer w0.5: U5.5 29.92,43.12 29.92,45.76 28.15,47.54 26.88,47.54 26.57,47.23 R13.2 R14.1
$1N7006: length 7.6
  Top Layer w0.5: 3.95,47.6 v4(4.65,48.3) ; 3.95,47.6 Q1.4 ; 3.95,47.6 3.95,47.78 R59.2 ; Q2.1 8.23,48.3 v4(8.84,48.3)
  Bottom Layer w0.5: v4(8.84,48.3) v4(4.65,48.3)
$1N7063: length 3.4
  Top Layer w0.5: Q1.1 Q1.2 Q1.3 5.19,44.28 5.36,44.11
$1N14594: length 1.5
  Top Layer w0.5: U12.4 36.49,30.2 36.49,29
$1N14595: length 6.3
  Top Layer w0.5: U12.1 36.68,34.86 36.91,35.09 v4(37.67,35.09) ; v4(41.1,35.47) C25.1
  Bottom Layer w0.5: v4(41.1,35.47) 38.05,35.47 v4(37.67,35.09)
$1N14596: length 3.2
  Top Layer w1.8: 44.53,40.75 45.22,40.06 45.22,37.89
$1N14599: length 1.5
  Top Layer w0.5: C28.1 45.42,30.21 45.42,31.59
$1N14601: length 3.4
  Top Layer w0.5: 43.96,30.37 44.02,30.44 44.02,31.86 43.83,31.66 U12.6
$1N14603: length 10.1
  Top Layer w0.5: U12.5 42.22,29.91 43,29.12 45.93,29.12 46.31,29.5 46.31,32.27 46.77,32.73 R39.2 47.07,34.03
$1N55959: length 6.5
  Top Layer w0.5: R18.2 55.39,13.45 55.33,13.45 ; 55.33,13.45 Q3.1 ; 55.33,13.45 R17.2 53.78,14.09 53.28,14.59 53.28,15.53
$1N59627: length 29.3
  Top Layer w0.5: CN8.2 53.42,29.38 51.51,27.47 40.84,27.47 ; 40.84,27.47 35.77,27.47 33.86,29.38 33.86,30.78 R32.1 36.56,31.55 U12.3 ; 40.84,27.47 R33.2
$1N62787: length 5.9
  Top Layer w0.5: 3.55,41.77 3.61,41.82 4.98,41.82 5.41,41.39 5.41,39.65 6.41,38.65 7.1,38.65
$1N73953: length 10.2
  Top Layer w0.5: 53.42,34.33 52.15,33.06 49.61,33.06 47.83,34.84 47.14,34.84 47.07,34.76 ; CN7.1 CN7.2
$1N74122: length 4.2
  Top Layer w0.5: CN7.4 48.65,36.69 R67.1
$2N529: length 2.7
  Top Layer w0.5: 58.81,20.98 58.81,20.99 R20.2 R21.2
$2N530: length 9.3
  Top Layer w0.5: 57.86,18.98 58.88,17.96 58.88,17.57 63.45,17.57 64.34,16.68 Q4.4
$2N536: length 7.6
  Top Layer w0.3: U20.8 66.8,21.64 64.8,23.63 F5.1
  Top Layer w2: 67.33,25.54 65.66,25.54 F5.1
$2N538: length 6.4
  Top Layer w2: 61.1,25.4 61.09,25.38 61.09,21.3 Q4.7 Q4.6
$2N1597: length 7.1
  Top Layer w0.5: R27.1 28.22,18.78 27.65,18.21 Q8.4 29.65,15.95 30.43,15.17
$2N1603: length 13.8
  Top Layer w0.3: U18.8 15.91,10.46 R26.2
  Top Layer w2: 20.4,17.36 18.67,17.36 17.66,16.36 17.66,11.28 16.59,10.2 R26.2
$2N1610: length 7.6
  Top Layer w0.5: R30.1 27.97,27.8 27.65,27.48 Q9.4 27.65,24.54 27.74,24.45 30.04,24.45 30.43,24.06
$2N1616: length 10
  Top Layer w0.3: U19.8 15.91,22.77 R29.2
  Top Layer w2: R29.2 17.61,23.2 17.61,25.7 18.55,26.64 F7.1
$2N3421: length 3.2
  Top Layer w0.5: 58.98,35.17 57.94,36.21 57.94,36.62 R40.2
$2N3422: length 9.4
  Top Layer w0.5: 58.03,33.17 58.88,32.32 58.88,31.41 63.45,31.41 64.34,30.52 Q10.4
$2N3428: length 4.3
  Top Layer w0.3: U21.8 66.8,35.31 64.8,37.3 F8.1
$2N3430: length 5.7
  Top Layer w2: Q10.6 Q10.7 ; 61,39 61,34.61
$2N4457: length 3.2
  Top Layer w0.5: 58.35,46.25 58.35,47.59 ; 58.34,47.57 58.32,47.55 56.46,47.55
$2N4458: length 8.7
  Top Layer w0.5: 58.91,43.78 58.45,44.24 57.4,44.24 ; Q14.4 64.34,43.35 63.91,43.78 R50.1
$2N4464: length 6.5
  Top Layer w0.3: U22.8 66.92,49.82 R51.2
  Top Layer w1.5: 69.62,53.54 67.78,51.7 67.78,50.59
$2N4466: length 8.3
  Top Layer w2: 65.41,53.64 65.41,50.49 62.69,47.77 ; Q14.7 Q14.6
$2N24815: length 2.8
  Top Layer w0.5: 31.38,17.17 31.38,18.7 R54.2 R53.2
$2N25317: length 5.3
  Top Layer w0.5: R56.2 31.37,26.05 31.38,26.06 30.94,26.5 R55.2
$2N39826: length 2
  Top Layer w0.5: 5.7,7.75 4.43,7.75 3.88,8.3
$2N39921: length 2.1
  Top Layer w0.5: R65.2 5.27,21.58 5.02,21.83 LED5.1
$2N39926: length 15.4
  Top Layer w0.3: R26.1 13.33,10.84 14.19,10.84 15.26,11.91 U18.7
  Top Layer w0.5: 8.3,11.94 5.68,9.32 5.68,8.65
  Top Layer w2: 12.57,10.23 11.1,10.23 9.1,12.22 9.1,14.45
$2N39937: length 16.7
  Top Layer w0.3: R29.1 15.26,23.82 U19.7
  Top Layer w0.5: 8.08,23.66 7.01,23.66 R65.1
  Top Layer w2: PWM1.2 8.78,27.86 8.78,23.85 10.49,22.14 R29.1
$2N40038: length 2.8
  Top Layer w0.5: R61.2 80.77,14.59 LED1.1
$2N40133: length 3
  Top Layer w0.5: LED2.1 80.64,28.69 R62.2
$2N40233: length 15.8
  Top Layer w0.3: U22.7 67.57,48.94 69,48.94 R51.1
  Top Layer w0.5: 74.01,49.83 74.08,49.91 ; 74.08,49.76 73.42,49.76 73.05,49.39 R86.2
  Top Layer w2: 74.08,49.76 73.77,50.08 70.18,50.08
$2N40244: length 17.5
  Top Layer w0.3: R43.1 70.28,39 67.44,36.17 U21.7
  Top Layer w0.5: R62.1 78.06,31.79 74.08,35.76
  Top Layer w2: 74.08,35.76 74.08,37.51 72.43,39.17
$2N40255: length 20.1
  Top Layer w0.3: 70.28,25.54 67.44,22.7 U20.7
  Top Layer w0.5: R61.1 78.18,17.44 74.08,21.54 74.08,21.76
  Top Layer w2: R23.1 71.73,25.54 74.08,23.19 74.08,21.76
$2N49861: length 3.3
  Top Layer w0.5: Q19.1 75.74,43.46 R86.1 R87.2
$2N50059: length 10.7
  Top Layer w0.5: 77.18,42.82 77.42,42.58 77.42,41.39 79.37,39.44 81.77,39.44 83.04,40.72 LED13.2
$2N57491: length 2.8
  Top Layer w0.5: LED13.1 80.13,42.09 R88.2

## Copper pours and planes (outline as drawn; the poured copper is in the pictures)
+3.3V on Bottom Layer: 9.42,41.76 10.29,41.76 10.29,40.47 9.42,40.47
+5V_A on Top Layer: 8.72,45.63 9.98,45.63 9.98,44.7 8.72,44.7
+5V_A on Top Layer: 8.33,43.7 11.45,43.7 11.45,41.25 8.33,41.25
+12V on Top Layer: 21.53,26.08 26.75,26.08 26.75,23.35 21.53,23.35
+12V on Top Layer: 33.45,41.69 37.8,41.69 37.8,32.47 33.45,32.47
+12V on Top Layer: 41.61,16.17 45.68,16.17 45.68,14.78 41.61,14.78
+12V on Top Layer: 21.53,17.07 26.75,17.07 26.75,14.34 21.53,14.34
+12V on Top Layer: 57.36,16.17 63.45,16.17 63.45,13.88 57.36,13.88
+12V on Top Layer: 57.48,30.16 63.58,30.16 63.58,27.88 57.48,27.88
+12V on Top Layer: 17.48,37.31 26.28,37.31 26.28,32.68 17.48,32.68
+12V on Inner2: 20.59,36.55 60.24,36.55 60.24,12.03 20.59,12.03
GND on Top Layer: -0.17,56.17 85.17,56.17 85.17,-0.09 -0.17,-0.09
GND on Bottom Layer: -0.17,56.17 85.19,56.17 85.19,-0.09 -0.17,-0.09
GND on Inner1: -0.17,56.17 85.17,56.17 85.17,-0.09 -0.17,-0.09
GND on Inner2: -0.17,56.17 85.17,56.17 85.17,-0.09 -0.17,-0.09
GND_IN on Top Layer: 38.42,13.89 49.94,13.89 49.94,2.19 38.42,2.19
GND_IN on Bottom Layer: 50.45,7.14 55.53,7.14 55.53,2.24 50.45,2.24
GND_IN on Inner2: 38.42,13.89 49.94,13.89 49.94,2.2 38.42,2.2
GND_IN on Inner2: 50.59,7.12 55.53,7.12 55.53,2.22 50.59,2.22
SDA on Bottom Layer: 14.48,18.11 15.34,18.11 15.34,16.83 14.48,16.83
VS on Top Layer: 61.55,43.22 63.49,43.22 63.49,40.68 61.55,40.68
$1N4920 on Top Layer: 17.22,45.51 24.97,45.51 24.97,40.55 17.22,40.55
$1N14596 on Top Layer: 41.1,40.43 46.18,40.43 46.18,33.82 41.1,33.82
$1N59627 on Top Layer: 40.19,28.06 41.46,28.06 41.46,27.17 40.19,27.17
$2N538 on Top Layer: 59.9,21.63 64.85,21.63 64.85,19.6 59.9,19.6
$2N1605 on Top Layer: 18.62,22.58 28.02,22.58 28.02,20.42 18.62,20.42
$2N1618 on Top Layer: 18.49,31.54 27.89,31.54 27.89,29.38 18.49,29.38
$2N3428 on Top Layer: 64.68,40 67.91,40 67.91,36.59 64.68,36.59
$2N3430 on Top Layer: 60.15,35.6 64.59,35.6 64.59,33.57 60.15,33.57
$2N4466 on Top Layer: 60.15,48.56 64.72,48.56 64.72,46.52 60.15,46.52
$2N40244 on Top Layer: 69.68,40.17 72.62,40.17 72.62,38.05 69.68,38.05

Small or netless copper shapes (teardrops, artwork), in the pictures only: 1 on Top Layer

## Text on the board
Bottom Silkscreen Layer: JLCJLCJLCJLC | GND | PWM1 / +12V | PWM2 / +12V | v1.1 | oshwlab.com/ / pololamag/ / astralim | 3.3V | SDA | SCL | 1-W | x | 12V | Vs | DC IN | DC3 / OUT | DC1 / OUT | DC2 / OUT | 1-Wire | I2C
Document Layer: 2 | Location ref. pin2 / from header Pi 40p: / => Center X = 52.5mm / => Center Y = -43.5mm
Top Silkscreen Layer: OUT3 / [Vs] | OUT2 / [12V] | OUT1 / [12V] | [12V] | GPS / VCC | GND | GPS / RXD | GPS / TXD | GPS / PPS | [mA] | 9V/5V | Disable Vt | 12V | RPi | v1.1 | Vt | Vs | 1-Wire | DC 12V IN | I2C OUT | XT30PW-M | 5V
